# Altium schematic sheet -ACC控制.SchDoc
size A4
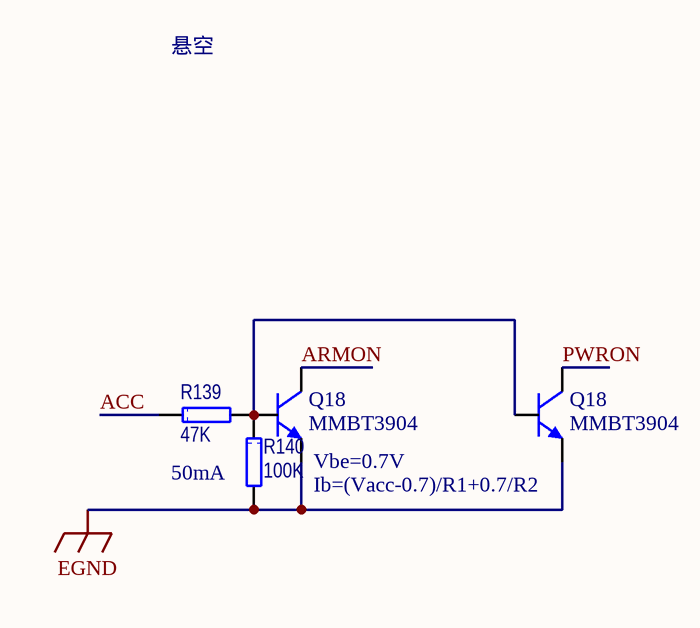
[diagram p0: -ACC控制.SchDoc]

## Parts
(Parts that share a designator on the sheet are numbered #1, #2 ... from top to bottom, then left to right.)
Q18#1  MMBT3904  [SOT23_N]
Q18#2  MMBT3904  [SOT23_N]
R139  47K  [0603R]
R140  100K  [0603R]

## Nets
EGND: Q18#1.1 Q18#2.1 R140.2
ACC: R139.1
ARMON: Q18#1.3
PWRON: Q18#2.3
NetQ18#1_2: Q18#1.2 Q18#2.2 R139.2 R140.1

## Notes on the sheet
- 悬空
- 50mA
- (near Q18#1) Vbe=0.7V
- (near Q18#2) Ib=(Vacc-0.7)/R1+0.7/R2

## Library data of the parts
R139 = RES: Manufacturer: vishay; Model: CRCW060347K0KKEDTR; Value: 47K; Type: 无铅电阻
R140 = RES: Manufacturer: vishay; Model: CRCW0603100K0KKEDTR; Value: 100K; Type: 无铅电阻